# EAGLE design Teensy_Board_Connectors (EAGLE 7.1.0)
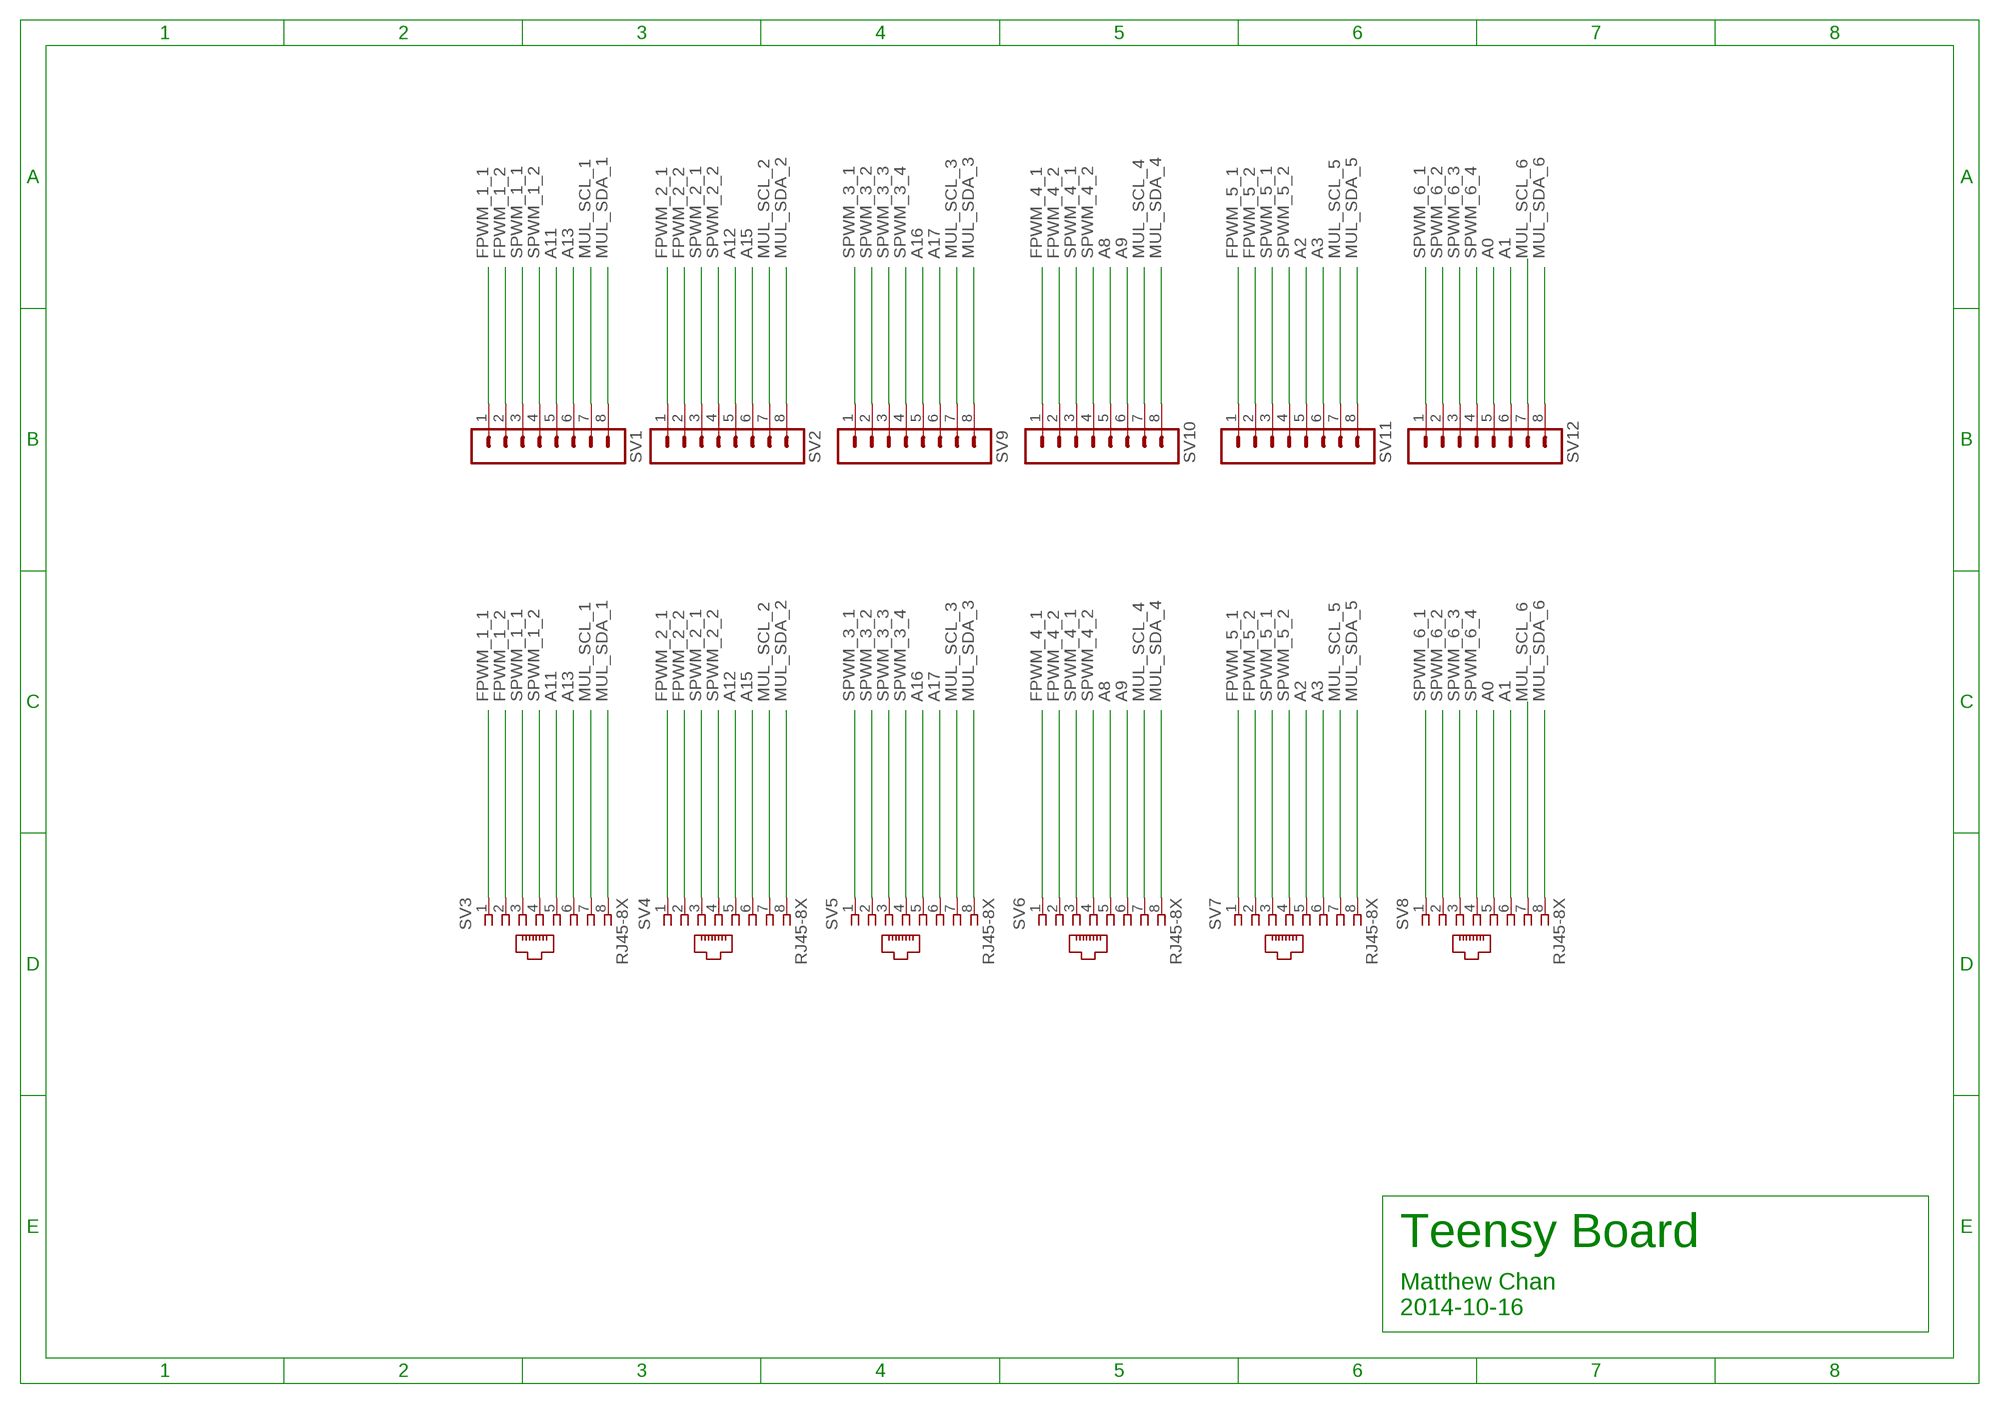
[diagram p0: schematic, sheet 1]

## Parts
SV1  MA08-1  [MA08-1]
SV2  MA08-1  [MA08-1]
SV3  RJ45-8X  [RJ45-NO-SHIELD]
SV4  RJ45-8X  [RJ45-NO-SHIELD]
SV5  RJ45-8X  [RJ45-NO-SHIELD]
SV6  RJ45-8X  [RJ45-NO-SHIELD]
SV7  RJ45-8X  [RJ45-NO-SHIELD]
SV8  RJ45-8X  [RJ45-NO-SHIELD]
SV9  MA08-1  [MA08-1]
SV10  MA08-1  [MA08-1]
SV11  MA08-1  [MA08-1]
SV12  MA08-1  [MA08-1]

## Nets
A0: SV8.5 SV12.5
A1: SV8.6 SV12.6
A2: SV7.5 SV11.5
A3: SV7.6 SV11.6
A8: SV6.5 SV10.5
A9: SV6.6 SV10.6
A11: SV1.5 SV3.5
A12: SV2.5 SV4.5
A13: SV1.6 SV3.6
A15: SV2.6 SV4.6
A16: SV5.5 SV9.5
A17: SV5.6 SV9.6
FPWM_1_1: SV1.1 SV3.1
FPWM_1_2: SV1.2 SV3.2
FPWM_2_1: SV2.1 SV4.1
FPWM_2_2: SV2.2 SV4.2
FPWM_4_1: SV6.1 SV10.1
FPWM_4_2: SV6.2 SV10.2
FPWM_5_1: SV7.1 SV11.1
FPWM_5_2: SV7.2 SV11.2
MUL_SCL_1: SV1.7 SV3.7
MUL_SCL_2: SV2.7 SV4.7
MUL_SCL_3: SV5.7 SV9.7
MUL_SCL_4: SV6.7 SV10.7
MUL_SCL_5: SV7.7 SV11.7
MUL_SCL_6: SV8.7 SV12.7
MUL_SDA_1: SV1.8 SV3.8
MUL_SDA_2: SV2.8 SV4.8
MUL_SDA_3: SV5.8 SV9.8
MUL_SDA_4: SV6.8 SV10.8
MUL_SDA_5: SV7.8 SV11.8
MUL_SDA_6: SV8.8 SV12.8
SPWM_1_1: SV1.3 SV3.3
SPWM_1_2: SV1.4 SV3.4
SPWM_2_1: SV2.3 SV4.3
SPWM_2_2: SV2.4 SV4.4
SPWM_3_1: SV5.1 SV9.1
SPWM_3_2: SV5.2 SV9.2
SPWM_3_3: SV5.3 SV9.3
SPWM_3_4: SV5.4 SV9.4
SPWM_4_1: SV6.3 SV10.3
SPWM_4_2: SV6.4 SV10.4
SPWM_5_1: SV7.3 SV11.3
SPWM_5_2: SV7.4 SV11.4
SPWM_6_1: SV8.1 SV12.1
SPWM_6_2: SV8.2 SV12.2
SPWM_6_3: SV8.3 SV12.3
SPWM_6_4: SV8.4 SV12.4

## Notes on the sheet
- Teensy Board
- Matthew Chan
  2014-10-16

## Library data of the parts
SV1 SV2 SV9-SV12 = con-lstb:MA08-1: PIN HEADER; OC_FARNELL: unknown; OC_NEWARK: unknown
SV3-SV8 = CBLA_Test_bed_Library:RJ45: CORCOM Modular RJ Jacks No Shield Source: www.tycoelectronics.com .. ENG_DS_1654001_1099_RJ_L_0507.pdf; MPN: RJ45-8X; OC_FARNELL: unknown; OC_NEWARK: 16R6101

## Board
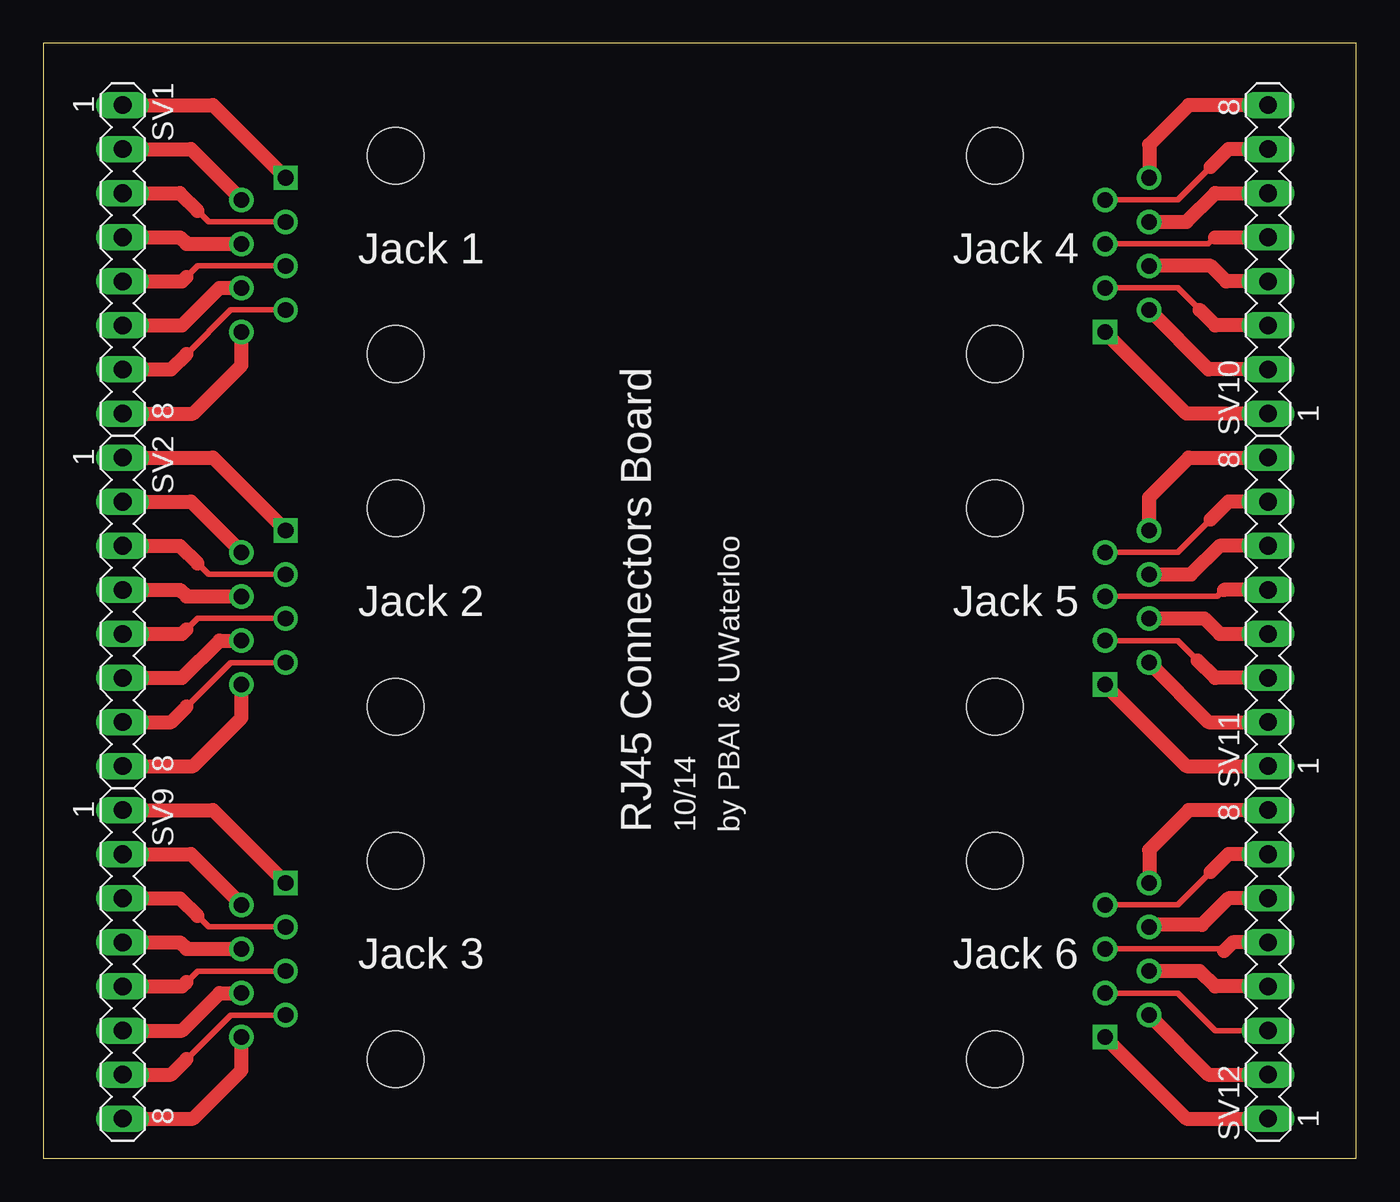
[diagram p1: board, top side]
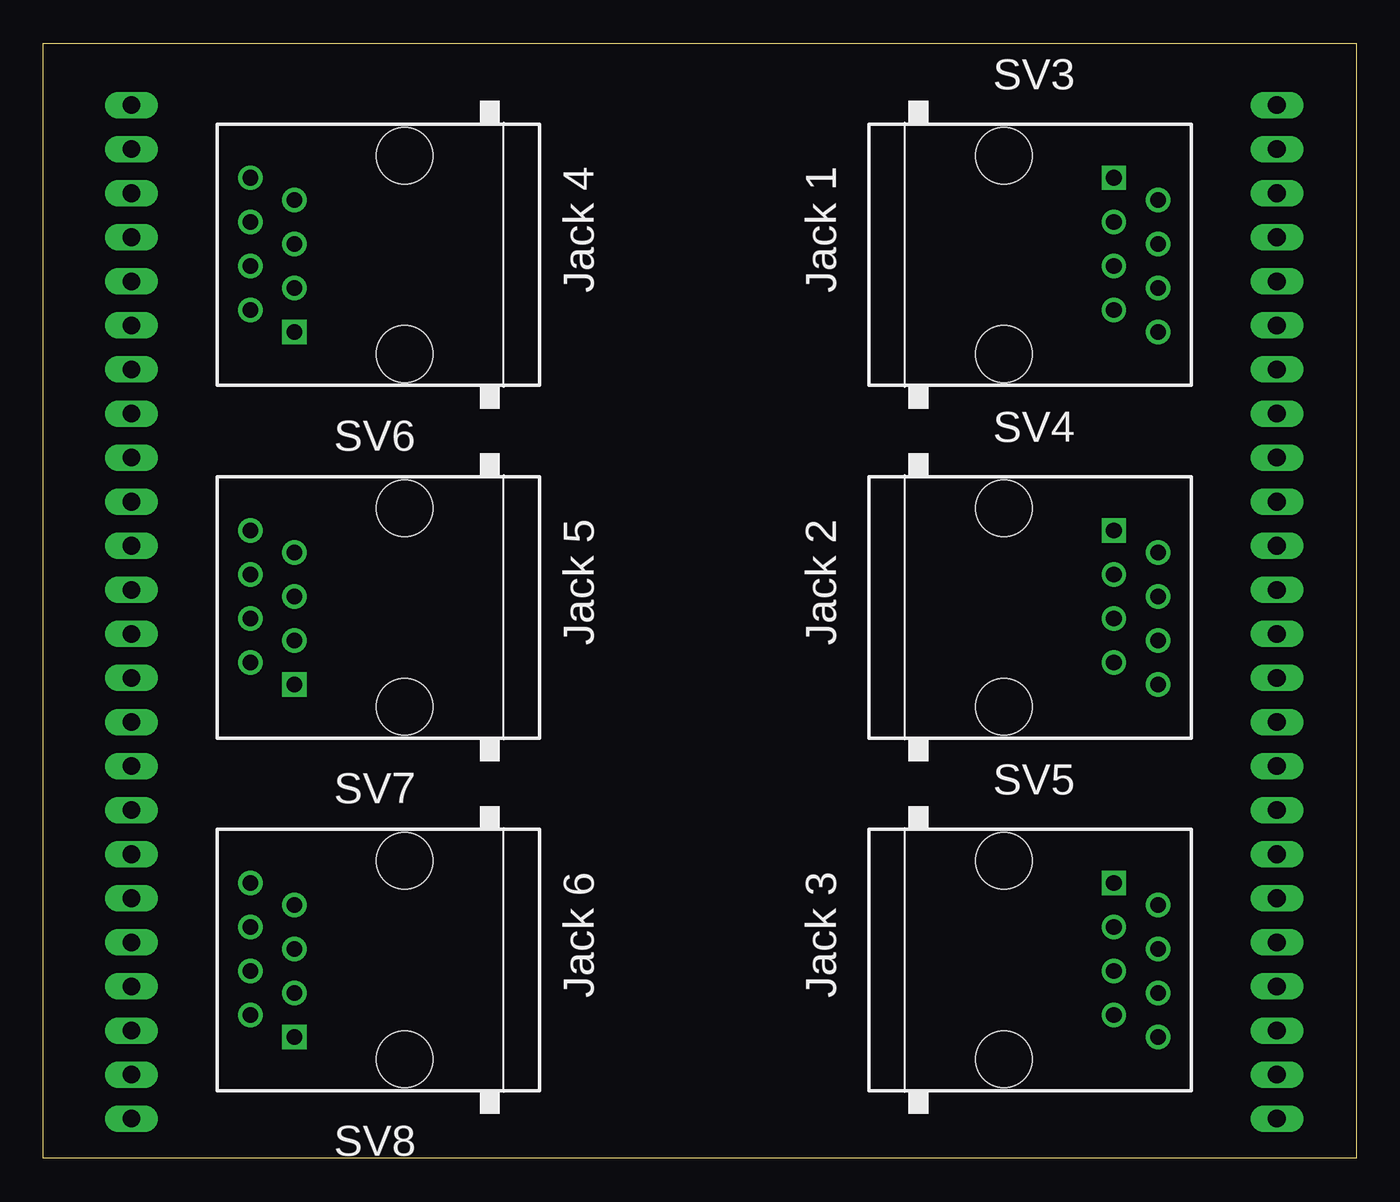
[diagram p2: board, bottom side, seen from below]

Size 75.69 x 64.26 mm. Coordinates in mm from the lower left corner, seen from the top.
Outline: 0,0 75.69,0 75.69,64.26 0,64.26 0,0
Copper layers (1*16): Top 0.035mm / dielectric 1.5mm / Bottom 0.035mm
Design rules "default": minimum track width 10mil, minimum drill 24mil, track to track 8mil, track to pad 8mil, pad to pad 8mil, via to via 8mil, smd to smd 8mil, copper to edge 40mil, drill to drill 8mil, minimum pad ring 10mil, minimum via ring 8mil, stop-mask expansion 4mil, vias tented up to drill 0mil, thermal gap 10mil

### Footprints (pad centres in the part's own frame; a part is rotated, then mirrored left to right if it is on the bottom)
MA08-1 = drill 1.016 long: 1 -8.89,0; 2 -6.35,0; 3 -3.81,0; 4 -1.27,0; 5 1.27,0; 6 3.81,0; 7 6.35,0; 8 8.89,0
RJ45-NO-SHIELD = drill 0.9 pad 1.4 square: 1 -4.445,6.35 | drill 0.9 pad 1.4: 2 -3.175,8.89; 3 -1.905,6.35; 4 -0.635,8.89; 5 0.635,6.35; 6 1.905,8.89; 7 3.175,6.35; 8 4.445,8.89 | hole 3.251: -5.715,0; 5.715,0

### Placement (x,y rotation side)
SV1  4.57,51.82 270 top
SV2  4.57,31.5 270 top
SV3  20.32,52.07 270 bottom
SV4  20.32,31.75 270 bottom
SV5  20.32,11.43 270 bottom
SV6  54.86,52.07 90 bottom
SV7  54.86,31.75 90 bottom
SV8  54.86,11.43 90 bottom
SV9  4.57,11.18 270 top
SV10  70.61,51.82 90 top
SV11  70.61,31.5 90 top
SV12  70.61,11.18 90 top

### Tracks (layer width: path | path; a pad name or v marks a point on that pad's centre or on a via)
A0
  Top 0.305: SV8.5 67.94,12.06 68.07,11.94
  Top 0.813: SV12.5 68.58,12.45 68.07,11.94
A1
  Top 0.813: SV12.6 68.33,14.99 66.8,13.46 63.88,13.46 SV8.6
A2
  Top 0.305: 68.07,32.77 67.69,32.39 SV7.5
  Top 0.813: SV11.5 68.07,32.77
A3
  Top 0.813: SV11.6 67.82,35.31 66.17,33.66 SV7.6
A8
  Top 0.305: SV6.5 67.18,52.7 67.56,53.09
  Top 0.813: 67.56,53.09 SV10.5
A9
  Top 0.813: SV6.6 65.91,53.97 67.56,55.63 SV10.6
A11
  Top 0.305: 8.26,50.8 8.89,51.43 SV3.5
  Top 0.813: SV1.5 8,50.55 8.26,50.8
A12
  Top 0.305: 8.26,30.48 8.89,31.11 SV4.5
  Top 0.813: SV2.5 8,30.23 8.26,30.48
A13
  Top 0.813: SV1.6 8,48.01 10.16,50.16 SV3.6
A15
  Top 0.813: SV2.6 8,27.69 10.16,29.84 SV4.6
A16
  Top 0.305: 8.26,10.16 8.89,10.79 SV5.5
  Top 0.813: SV9.5 8,9.91 8.26,10.16
A17
  Top 0.813: SV9.6 8,7.37 10.16,9.52 SV5.6
FPWM_1_1
  Top 0.813: SV1.1 9.78,60.71 SV3.1
FPWM_1_2
  Top 0.813: SV1.2 8.51,58.17 SV3.2
FPWM_2_1
  Top 0.813: SV2.1 9.78,40.39 SV4.1
FPWM_2_2
  Top 0.813: SV2.2 8.51,37.85 SV4.2
FPWM_4_1
  Top 0.813: SV10.1 65.91,42.93 SV6.1
FPWM_4_2
  Top 0.813: SV10.2 67.18,45.47 SV6.2
FPWM_5_1
  Top 0.813: SV7.1 65.91,22.61 SV11.1
FPWM_5_2
  Top 0.813: SV7.2 67.18,25.15 SV11.2
MUL_SCL_1
  Top 0.305: 8.26,46.36 10.79,48.89 SV3.7
  Top 0.813: SV1.7 7.37,45.47 8.26,46.36
MUL_SCL_2
  Top 0.305: 8.26,26.04 10.79,28.57 SV4.7
  Top 0.813: SV2.7 7.37,25.15 8.26,26.04
MUL_SCL_3
  Top 0.305: 8.26,5.71 10.79,8.25 SV5.7
  Top 0.813: SV9.7 7.37,4.83 8.26,5.71
MUL_SCL_4
  Top 0.305: SV6.7 65.41,55.24 67.31,57.15
  Top 0.813: SV10.7 68.33,58.17 67.31,57.15
MUL_SCL_5
  Top 0.305: 67.31,36.83 65.41,34.92 SV7.7
  Top 0.813: SV11.7 68.33,37.85 67.31,36.83
MUL_SCL_6
  Top 0.305: SV8.7 65.41,14.6 67.31,16.51
  Top 0.813: SV12.7 68.33,17.53 67.31,16.51
MUL_SDA_1
  Top 0.813: SV1.8 8.64,42.93 11.43,45.72 SV3.8
MUL_SDA_2
  Top 0.813: SV2.8 8.64,22.61 11.43,25.4 SV4.8
MUL_SDA_3
  Top 0.813: SV9.8 8.64,2.29 11.43,5.08 SV5.8
MUL_SDA_4
  Top 0.813: SV10.8 66.04,60.71 63.75,58.42 SV6.8
MUL_SDA_5
  Top 0.813: SV7.8 63.75,38.1 66.04,40.39 SV11.8
MUL_SDA_6
  Top 0.813: SV12.8 66.04,20.07 63.75,17.78 SV8.8
SPWM_1_1
  Top 0.305: 8.89,54.61 9.53,53.97 SV3.3
  Top 0.813: SV1.3 7.87,55.63 8.89,54.61
SPWM_1_2
  Top 0.813: SV1.4 7.87,53.09 8.26,52.7 SV3.4
SPWM_2_1
  Top 0.305: 8.89,34.29 9.53,33.66 SV4.3
  Top 0.813: SV2.3 7.87,35.31 8.89,34.29
SPWM_2_2
  Top 0.813: SV2.4 7.87,32.77 8.26,32.39 SV4.4
SPWM_3_1
  Top 0.813: SV9.1 9.78,20.07 SV5.1
SPWM_3_2
  Top 0.813: SV9.2 8.51,17.53 SV5.2
SPWM_3_3
  Top 0.305: 8.89,13.97 9.53,13.33 SV5.3
  Top 0.813: SV9.3 7.87,14.99 8.89,13.97
SPWM_3_4
  Top 0.813: SV9.4 7.87,12.45 8.26,12.06 SV5.4
SPWM_4_1
  Top 0.305: SV6.3 65.41,50.16 66.67,48.89
  Top 0.813: SV10.3 67.56,48.01 66.67,48.89
SPWM_4_2
  Top 0.813: SV10.4 68.2,50.55 67.31,51.43 SV6.4
SPWM_5_1
  Top 0.305: SV7.3 65.41,29.84 66.55,28.7
  Top 0.813: SV11.3 67.56,27.69 66.55,28.7
SPWM_5_2
  Top 0.813: SV7.4 66.93,31.11 67.82,30.23 SV11.4
SPWM_6_1
  Top 0.813: SV8.1 65.91,2.29 SV12.1
SPWM_6_2
  Top 0.813: SV8.2 67.18,4.83 SV12.2
SPWM_6_3
  Top 0.305: SV8.3 65.41,9.52 67.56,7.37 SV12.3
SPWM_6_4
  Top 0.813: SV12.4 67.56,9.91 66.67,10.79 SV8.4

### Text on the board
tPlace: Jack 1 | Jack 4 | Jack 2 | Jack 5 | RJ45 Connectors Board | 10/14 | by PBAI & UWaterloo | Jack 3 | Jack 6
bPlace: Jack 1 | Jack 4 | Jack 2 | Jack 5 | Jack 3 | Jack 6